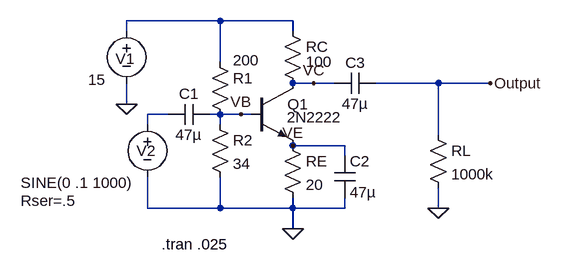
[diagram p0: schematic ce3.asc]
ce3.asc, the LTspice schematic file:
Version 4
SHEET 1 1160 680
WIRE -64 -112 -208 -112
WIRE 48 -112 -64 -112
WIRE -208 -96 -208 -112
WIRE 48 -96 48 -112
WIRE -64 -48 -64 -112
WIRE 80 -16 48 -16
WIRE 112 -16 80 -16
WIRE 272 -16 176 -16
WIRE 352 -16 272 -16
WIRE -208 16 -208 -16
WIRE -144 32 -176 32
WIRE -64 32 -80 32
WIRE -32 32 -64 32
WIRE -16 32 -32 32
WIRE -176 48 -176 32
WIRE -64 48 -64 32
WIRE 272 64 272 -16
WIRE 128 80 48 80
WIRE 128 96 128 80
WIRE -176 176 -176 128
WIRE -64 176 -64 128
WIRE -64 176 -176 176
WIRE 48 176 48 160
WIRE 48 176 -64 176
WIRE 128 176 128 160
WIRE 128 176 48 176
WIRE 272 176 272 144
WIRE 48 208 48 176
FLAG 48 208 0
FLAG -208 16 0
FLAG -32 32 VB
FLAG 272 176 0
FLAG 80 -16 VC
FLAG 48 80 VE
FLAG 352 -16 Output
SYMBOL npn -16 -16 R0
WINDOW 3 55 52 Left 2
SYMATTR InstName Q1
SYMATTR Value 2N2222
SYMBOL res -80 -64 R0
WINDOW 3 36 13 Left 2
SYMATTR InstName R1
SYMATTR Value 200
SYMBOL res -80 32 R0
SYMATTR InstName R2
SYMATTR Value 34
SYMBOL res 32 64 R0
SYMATTR InstName RE
SYMATTR Value 20
SYMBOL res 32 -112 R0
WINDOW 3 36 63 Left 2
SYMATTR InstName RC
SYMATTR Value 100
SYMBOL voltage -208 -112 R0
WINDOW 0 -17 58 Left 2
WINDOW 3 -59 91 Left 2
WINDOW 123 0 0 Left 2
WINDOW 39 0 0 Left 2
SYMATTR InstName V1
SYMATTR Value 15
SYMBOL res 256 48 R0
SYMATTR InstName RL
SYMATTR Value 1000k
SYMBOL voltage -176 32 R0
WINDOW 0 -17 56 Left 2
WINDOW 3 -195 105 Left 2
WINDOW 123 0 0 Left 2
WINDOW 39 -195 133 Left 2
SYMATTR InstName V2
SYMATTR Value SINE(0 .1 1000)
SYMATTR SpiceLine Rser=.5
SYMBOL cap -80 16 R90
WINDOW 0 0 32 VBottom 2
WINDOW 3 32 32 VTop 2
SYMATTR InstName C1
SYMATTR Value 47µ
SYMBOL cap 112 96 R0
SYMATTR InstName C2
SYMATTR Value 47µ
SYMBOL cap 176 -32 R90
WINDOW 0 0 32 VBottom 2
WINDOW 3 32 32 VTop 2
SYMATTR InstName C3
SYMATTR Value 47µ
TEXT -154 232 Left 2 !.tran .025

The netlist it stands for:
* ce3.asc
Q1 VC VB VE 0 2N2222
R1 N001 VB 200
R2 VB 0 34
RE VE 0 20
RC N001 VC 100
V1 N001 0 15
RL Output 0 1000k
V2 N002 0 SINE(0 .1 1000) Rser=.5
C1 VB N002 47µ
C2 VE 0 47µ
C3 Output VC 47µ
.model NPN NPN
.model PNP PNP
.lib standard.bjt
.tran .025
.backanno
.end